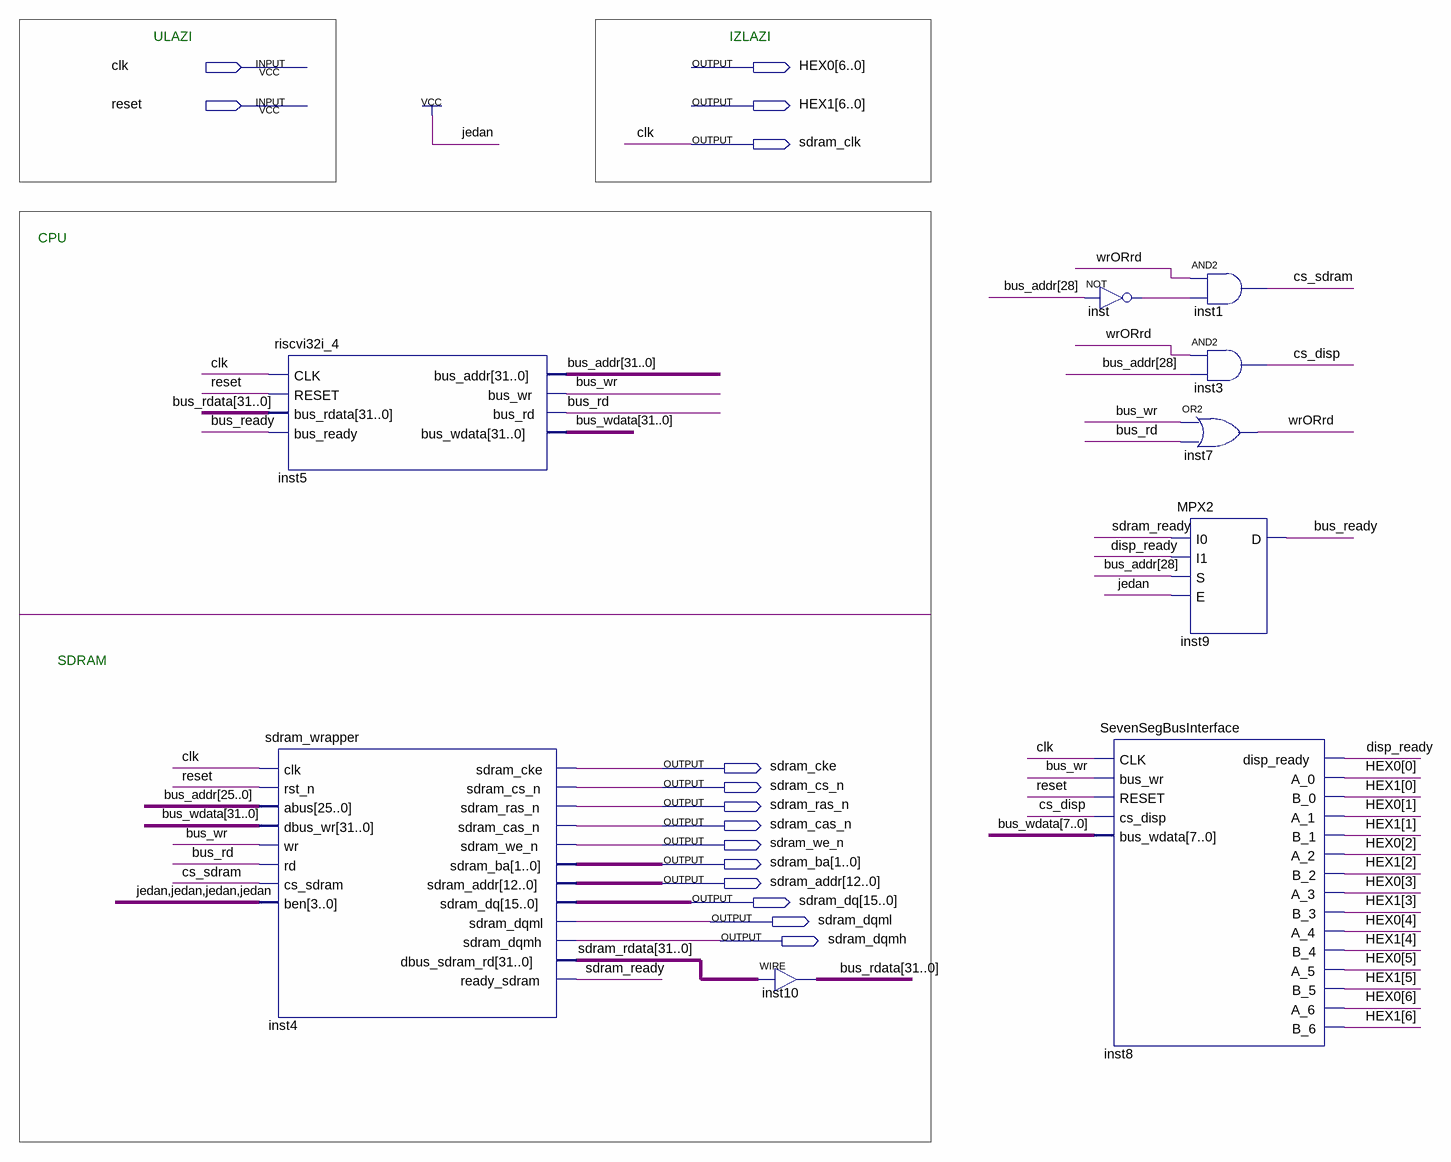
[diagram p0: schematic sheet]
// Quartus schematic CpuSdramTest.bdf as structural Verilog: 9 symbols, 15 pins
module CpuSdramTest (
  input  clk,
  input  reset,
  output [6:0] HEX0,
  output [6:0] HEX1,
  output sdram_clk,
  output sdram_cke,
  output sdram_cs_n,
  output sdram_ras_n,
  output sdram_cas_n,
  output sdram_we_n,
  output [1:0] sdram_ba,
  output [12:0] sdram_addr,
  output [15:0] sdram_dq,
  output sdram_dqml,
  output sdram_dqmh
);

  wire bus_rd, bus_ready, bus_wr, cs_disp, cs_sdram, disp_ready, inst_out, sdram_ready, wrORrd;
  wire [31:0] bus_addr, bus_rdata, bus_wdata, sdram_rdata;

  riscvi32i_4 inst5 (
    .CLK(clk), .RESET(reset), .bus_rdata(bus_rdata), .bus_ready(bus_ready), .bus_addr(bus_addr),
    .bus_wr(bus_wr), .bus_rd(bus_rd), .bus_wdata(bus_wdata));
  sdram_wrapper inst4 (
    .clk(clk), .rst_n(reset), .abus(bus_addr[25:0]), .dbus_wr(bus_wdata), .wr(bus_wr), .rd(bus_rd),
    .cs_sdram(cs_sdram), .ben(4'b1111), .sdram_cke(sdram_cke), .sdram_cs_n(sdram_cs_n),
    .sdram_ras_n(sdram_ras_n), .sdram_cas_n(sdram_cas_n), .sdram_we_n(sdram_we_n), .sdram_ba(sdram_ba),
    .sdram_addr(sdram_addr), .sdram_dqml(sdram_dqml), .sdram_dqmh(sdram_dqmh), .dbus_sdram_rd(sdram_rdata),
    .ready_sdram(sdram_ready), .sdram_dq(sdram_dq));
  assign bus_rdata = sdram_rdata;  // WIRE inst10
  not inst (inst_out, bus_addr[28]);
  SevenSegBusInterface inst8 (
    .CLK(clk), .bus_wr(bus_wr), .RESET(reset), .cs_disp(cs_disp), .bus_wdata(bus_wdata[7:0]),
    .disp_ready(disp_ready), .A_0(HEX0[0]), .B_0(HEX1[0]), .A_1(HEX0[1]), .B_1(HEX1[1]), .A_2(HEX0[2]),
    .B_2(HEX1[2]), .A_3(HEX0[3]), .B_3(HEX1[3]), .A_4(HEX0[4]), .B_4(HEX1[4]), .A_5(HEX0[5]), .B_5(HEX1[5]),
    .A_6(HEX0[6]), .B_6(HEX1[6]));
  and inst1 (cs_sdram, wrORrd, inst_out);
  and inst3 (cs_disp, wrORrd, bus_addr[28]);
  or inst7 (wrORrd, bus_wr, bus_rd);
  MPX2 inst9 (.I0(sdram_ready), .I1(disp_ready), .S(bus_addr[28]), .E(1'b1), .D(bus_ready));

  assign sdram_clk = clk;

  // Notes on the sheet:
  //   ULAZI
  //   IZLAZI
  //   CPU
  //   SDRAM
endmodule
